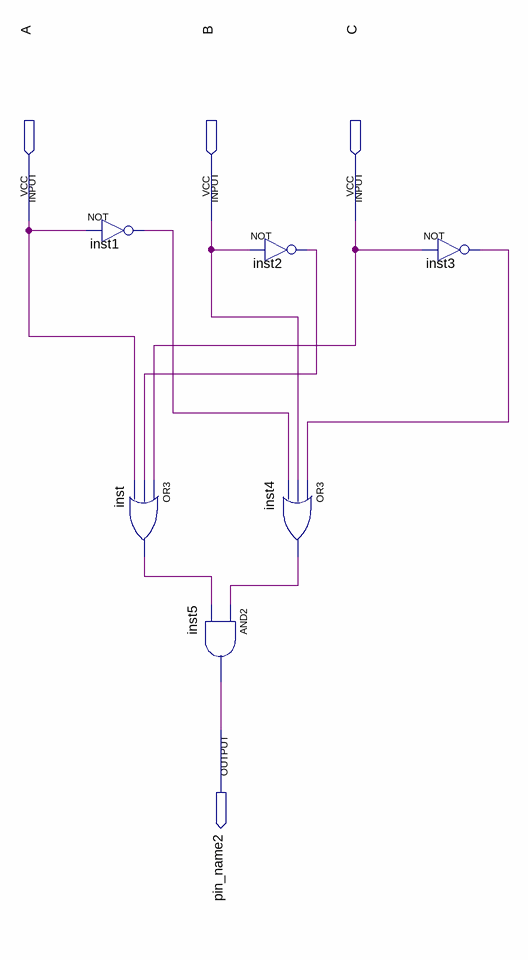
[diagram p0: schematic sheet]
// Quartus schematic DigitalCircuit.bdf as structural Verilog: 6 symbols, 4 pins
module DigitalCircuit (
  input  A,
  input  B,
  input  C,
  output pin_name2
);

  wire inst1_out, inst2_out, inst3_out, inst4_out, inst_out;

  not inst1 (inst1_out, A);
  or inst (inst_out, C, inst2_out, A);
  and inst5 (pin_name2, inst4_out, inst_out);
  not inst2 (inst2_out, B);
  or inst4 (inst4_out, inst3_out, B, inst1_out);
  not inst3 (inst3_out, C);
endmodule
